# Altium schematic sheet GOMSIS.SchDoc
size A4; SheetNumber: 4; SheetTotal: 4
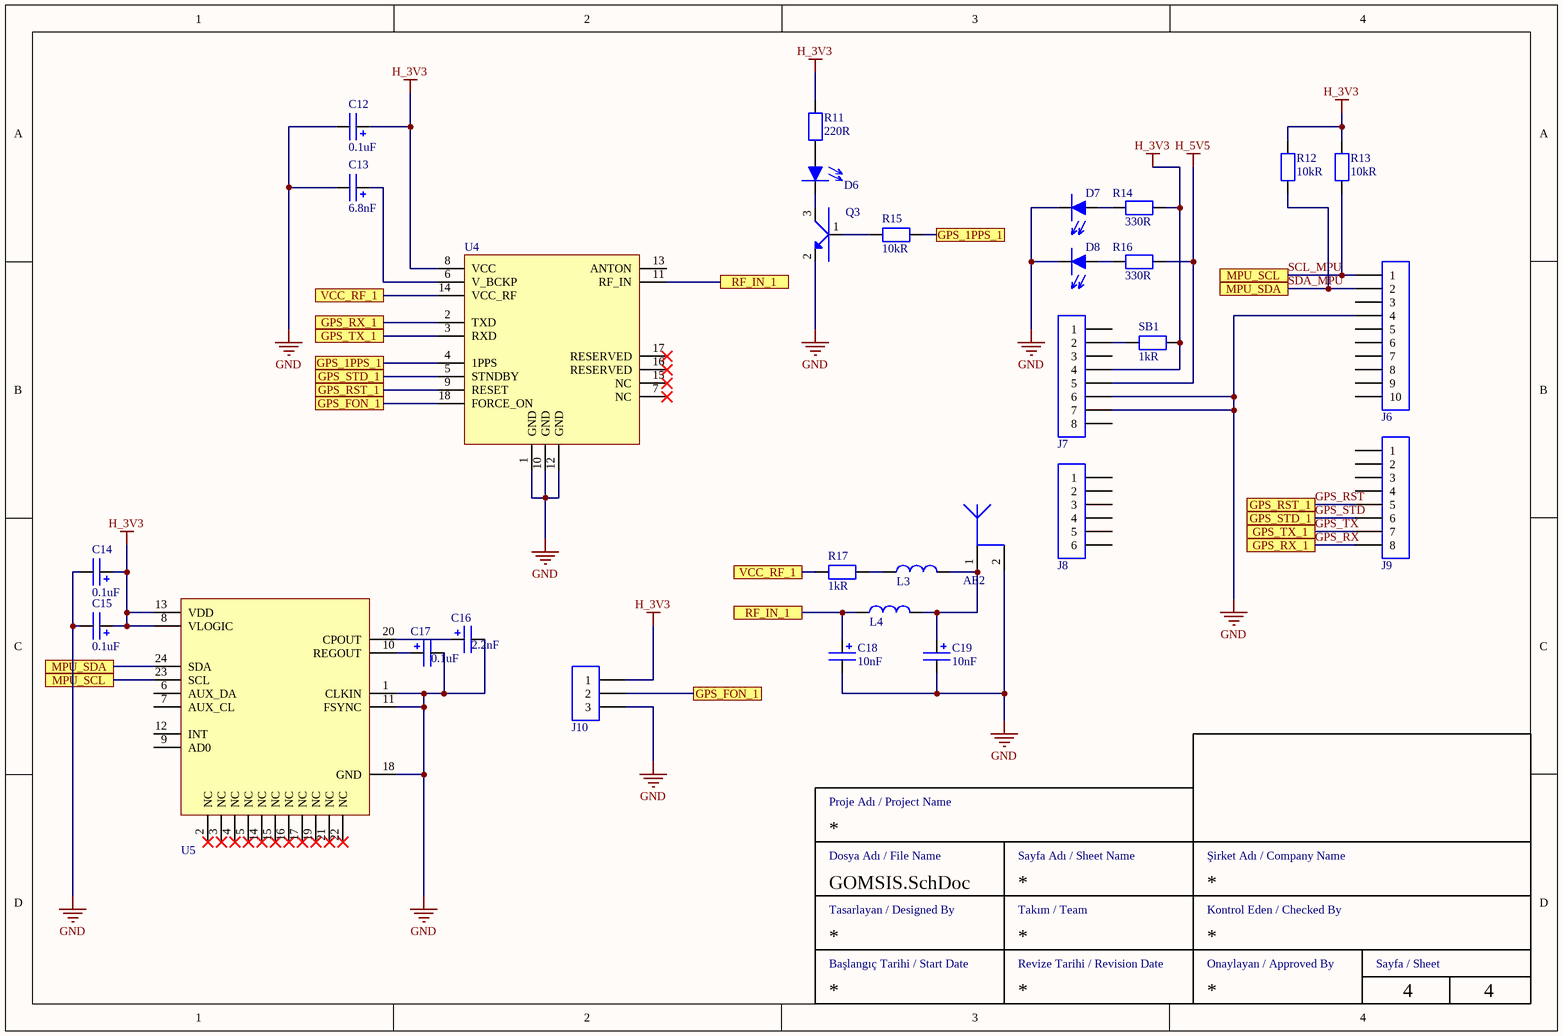
[diagram p0: GOMSIS.SchDoc]

## Parts
AE2  UFL Connector  [UFL CONN]  (value not drawn)
C12  value 0.1uF  [CAP 0603]  (hidden comment: CAP 0603)
C13  value 6.8nF  [CAP 0603]  (hidden comment: CAP 0603)
C14  value 0.1uF  [CAP 0603]  (hidden comment: CAP 0603)
C15  value 0.1uF  [CAP 0603]  (hidden comment: CAP 0603)
C16  value 2.2nF  [CAP 0603]  (hidden comment: CAP 0603)
C17  value 0.1uF  [CAP 0603]  (hidden comment: CAP 0603)
C18  value 10nF  [CAP 0603]  (hidden comment: CAP 0603)
C19  value 10nF  [CAP 0603]  (hidden comment: CAP 0603)
D6  LTW-C191TLA  [LED 0603]  (value not drawn)
D7  LTW-C191TLA  [LED 0603]  (value not drawn)
D8  LTW-C191TLA  [LED 0603]  (value not drawn)
J6  HMATHT00C101  [HMATHT00C101]  (value not drawn)
J7  HMATHT00C81  [HMATHT00C81 - duplicate]  (value not drawn)
J8  5-146285-6  [HMATHT00C61]  (value not drawn)
J9  HMATHT00C81  [HMATHT00C81 - duplicate]  (value not drawn)
J10  146285-3  [HMATHT00C31]  (value not drawn)
L3  IND 0603  [INDUCTOR 0603]  (value not drawn)
L4  IND 0603  [INDUCTOR 0603]  (value not drawn)
Q3  BC817-40  [SOT23-3]  (value not drawn)
R11  value 220R  [RESISTOR 0603]  (hidden comment: RES 0603)
R12  value 10kR  [RESISTOR 0603]  (hidden comment: RES 0603)
R13  value 10kR  [RESISTOR 0603]  (hidden comment: RES 0603)
R14  value 330R  [RESISTOR 0603]  (hidden comment: RES 0603)
R15  value 10kR  [RESISTOR 0603]  (hidden comment: RES 0603)
R16  value 330R  [RESISTOR 0603]  (hidden comment: RES 0603)
R17  value 1kR  [RESISTOR 0603]  (hidden comment: RES 0603)
SB1  value 1kR  [RESISTOR 0603]  (hidden comment: RES 0603)
U4  L76M33  [L76M33]  (value not drawn)
U5  MPU6050  [QFN24]  (value not drawn)

## Ports
GPS_1PPS_1, GPS_FON_1, GPS_RST_1, GPS_RX_1, GPS_STD_1, GPS_TX_1, MPU_SCL, MPU_SDA, RF_IN_1, VCC_RF_1

## Nets
GND: AE2.2 C12.2 C13.2 C14.2 C15.2 C16.2 C17.2 C18.2 C19.2 D7.1 D8.1 J6.4 J7.6 J7.7 J10.3 Q3.2(S) U4.1(GND) U4.10(GND) U4.12(GND) U5.1(CLKIN) U5.11(FSYNC) U5.18(GND)
H_3V3: C12.1 C14.1 C15.1 J7.4 J10.1 R11.2 R12.2 R13.2 R14.1 SB1.1 U4.8(VCC) U5.8(VLOGIC) U5.13(VDD)
H_5V5: J7.5 R16.1
GPS_1PPS_1: R15.2 U4.4(1PPS) ; port GPS_1PPS_1
GPS_FON_1: J10.2 U4.18(FORCE_ON) ; port GPS_FON_1
GPS_RST: J9.5 U4.9(RESET) ; port GPS_RST_1
GPS_RX: J9.8 U4.2(TXD) ; port GPS_RX_1
GPS_STD: J9.6 U4.5(STNDBY) ; port GPS_STD_1
GPS_TX: J9.7 U4.3(RXD) ; port GPS_TX_1
RF_IN_1: C18.1 L4.1 U4.11(RF_IN) ; port RF_IN_1
SCL_MPU: J6.1 R13.1 U5.23(SCL) ; port MPU_SCL
SDA_MPU: J6.2 R12.1 U5.24(SDA) ; port MPU_SDA
VCC_RF_1: R17.1 U4.14(VCC_RF) ; port VCC_RF_1
NetAE2_1: AE2.1 C19.1 L3.2 L4.2
NetC13_1: C13.1 U4.6(V_BCKP)
NetC16_1: C16.1 U5.20(CPOUT)
NetC17_1: C17.1 U5.10(REGOUT)
NetD6_1: D6.1 Q3.3(D)
NetD6_2: D6.2 R11.1
NetD7_2: D7.2 R14.2
NetD8_2: D8.2 R16.2
NetJ7_2: J7.2 SB1.2
NetL3_1: L3.1 R17.2
NetQ3_1: Q3.1(G) R15.1

Not connected (* = marked no-connect by the designer): J6 3 5 6 7 8 9 10; J7 1 3 8; J8 1 2 3 4 5 6; J9 1 2 3 4; U4 7(NC)* 13(ANTON) 15(NC)* 16(RESERVED)* 17(RESERVED)*; U5 2(NC)* 3(NC)* 4(NC)* 5(NC)* 6(AUX_DA) 7(AUX_CL) 9(AD0) 12(INT) 14(NC)* 15(NC)* 16(NC)* 17(NC)* 19(NC)* 21(NC)* 22(NC)*

## Notes on the sheet
- Dosya Adı / File Name
- Proje Adı / Project Name
- Sayfa Adı / Sheet Name
- Şirket Adı / Company Name
- Tasarlayan / Designed By
- Takım / Team
- Kontrol Eden / Checked By
- Başlangıç Tarihi / Start Date
- Revize Tarihi / Revision Date
- Onaylayan / Approved By
- Sayfa / Sheet

## Library data of the parts
AE2 = UFL Connector: Antenna Connector
C12-C19 = CAP 0603: Multilayer Ceramic Capacitor; Capacitor Type: MLCC; Case/Package: 0603
D6-D8 = LED 0603: Chip LED; Case/Package: 0603
J6 = HMATHT00C101: Header for PCB
J7 J9 = HMATHT00C81: Header for PCB
J8 = HMATHT00C61: Header for PCB
J10 = HMATHT00C31: Header for PCB
L3 L4 = IND 0603: SMD Inductor
Q3 = BC817-40: Transistor BJT; Transistor Type: NPN; Voltage: 45V; Current: 500mA; Case/Package: SOT23
R11-R17 SB1 = RES 0603: SMD Chip Resistor; Case/Package: 0603
U4 = L76M33: GPS, GLONASS, GNSS Transceiver
U5 = MPU6050: IMU